# Altium project 5V-REG.PrjPcb
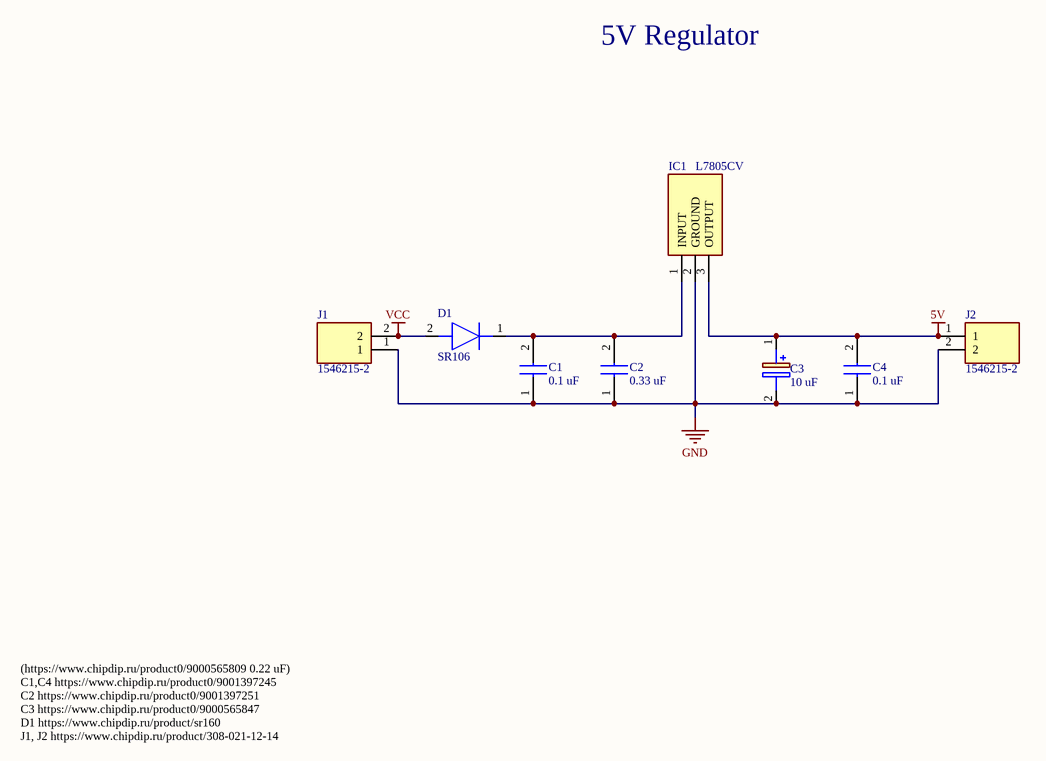
[diagram p0: 5V-REG.SchDoc]
1 sheet, 8 parts. Net scope: global (net labels, ports and power ports of the same name join across sheets).
Board file: 5V-REG.PcbDoc

## Sheet 5V-REG.SchDoc
size A4; SheetNumber: 1; SheetTotal: 1

### Parts
C1  0.1 uF  [C323C104J5R5TA]
C2  0.33 uF  [C323C104J5R5TA]
C3  10 uF  [CAPPRD200W50D525H1250]
C4  0.1 uF  [C323C104J5R5TA]
D1  SR106  [DIOAD1408W86L464D236]
IC1  L7805CV  [TO255P460X1020X2008-3P]
J1  1546215-2  [15462152]
J2  1546215-2  [15462152]

### Nets
5V: C3.1(+) C4.2 IC1.3(OUTPUT) J2.1
GND: C1.1 C2.1 C3.2(-) C4.1 IC1.2(GROUND) J1.1 J2.2
VCC: D1.2(A) J1.2
NetC1_2: C1.2 C2.2 D1.1(K) IC1.1(INPUT)

### Notes on the sheet
- 5V Regulator
- (https://www.chipdip.ru/product0/9000565809 0.22 uF)
  C1,C4 https://www.chipdip.ru/product0/9001397245
  C2 https://www.chipdip.ru/product0/9001397251
  C3 https://www.chipdip.ru/product0/9000565847
  D1 https://www.chipdip.ru/product/sr160
  J1, J2 https://www.chipdip.ru/product/308-021-12-14

### Library data of the parts
C1 C2 C4 = C323C104J5R5TA: Capacitor; Manufacturer_Name: KEMET; Datasheet Link: https://search.kemet.com/component-documentation/download/specsheet/C323C104J5R5TA; Height: 7.62mm; Manufacturer_Part_Number: C323C104J5R5TA; Mouser Part Number: 80-C323C104J5R; Mouser Price/Stock: https://www.mouser.co.uk/ProductDetail/KEMET/C323C104J5R5TA?qs=Qblnm30vzmKCqy99RB1Stw%3D%3D; Arrow Part Number: C323C104J5R5TA; Arrow Price/Stock: null?region=nac
C3 = 35ZLR56MEFC5X11: Capacitor Polarised; Manufacturer_Name: Rubycon; Datasheet Link: https://www.rubycon.co.jp/wp-content/uploads/catalog-aluminum/ZLR.pdf; Height: 12.5mm; Manufacturer_Part_Number: 35ZLR56MEFC5X11; Mouser Part Number: 232-35ZLR56MEFC5X11; Mouser Price/Stock: https://www.mouser.co.uk/ProductDetail/Rubycon/35ZLR56MEFC5X11?qs=iLKYxzqNS77NwHRl7g4ApQ%3D%3D
D1 = 1N5817-T: Diode; Manufacturer_Name: Diodes Incorporated; Datasheet Link: http://uk.rs-online.com/web/p/products/8855356P; Manufacturer_Part_Number: 1N5817-T; Mouser Part Number: 621-1N5817; Mouser Price/Stock: https://www.mouser.co.uk/ProductDetail/Diodes-Incorporated/1N5817-T?qs=d3C4ppQ%252BH%2FfTp29c2mqM%252Bg%3D%3D; Arrow Part Number: 1N5817-T; Arrow Price/Stock: https://www.arrow.com/en/products/1n5817-t/diodes-incorporated?region=nac
IC1 = L7805CV: Integrated Circuit; Manufacturer_Name: STMicroelectronics; Datasheet Link: http://www.st.com/web/en/resource/technical/document/datasheet/CD00000444.pdf; Height: 4.6mm; Manufacturer_Part_Number: L7805CV; Mouser Part Number: 511-L7805CV; Mouser Price/Stock: https://www.mouser.co.uk/ProductDetail/STMicroelectronics/L7805CV?qs=9NrABl3fj%2FqplZAHiYUxWg%3D%3D; Arrow Part Number: L7805CV; Arrow Price/Stock: https://www.arrow.com/en/products/l7805cv/stmicroelectronics?utm_currency=USD&region=europe
J1 J2 = 1546215-2: Connector; Manufacturer_Name: TE Connectivity; Datasheet Link: https://www.te.com/commerce/DocumentDelivery/DDEController?Action=srchrtrv&DocNm=1-1773458-1_EURO_STYLE_QRG&DocType=Data%20Sheet&DocLang=English&PartCntxt=1546215-2&DocFormat=pdf; Height: 10.3mm; Manufacturer_Part_Number: 1546215-2; Mouser Part Number: 571-1546215-2; Mouser Price/Stock: https://www.mouser.co.uk/ProductDetail/TE-Connectivity/1546215-2?qs=Lxq28tKK6BPmJFoAOY7Ljw%3D%3D; Arrow Part Number: 1546215-2; Arrow Price/Stock: https://www.arrow.com/en/products/1546215-2/te-connectivity?utm_currency=USD&region=nac